# Altium schematic sheet LF_SFF_AC_DC.SchDoc: LF SFF ADC/DC
size A3; Author: Dominic Schüchter; Revision: v1.0
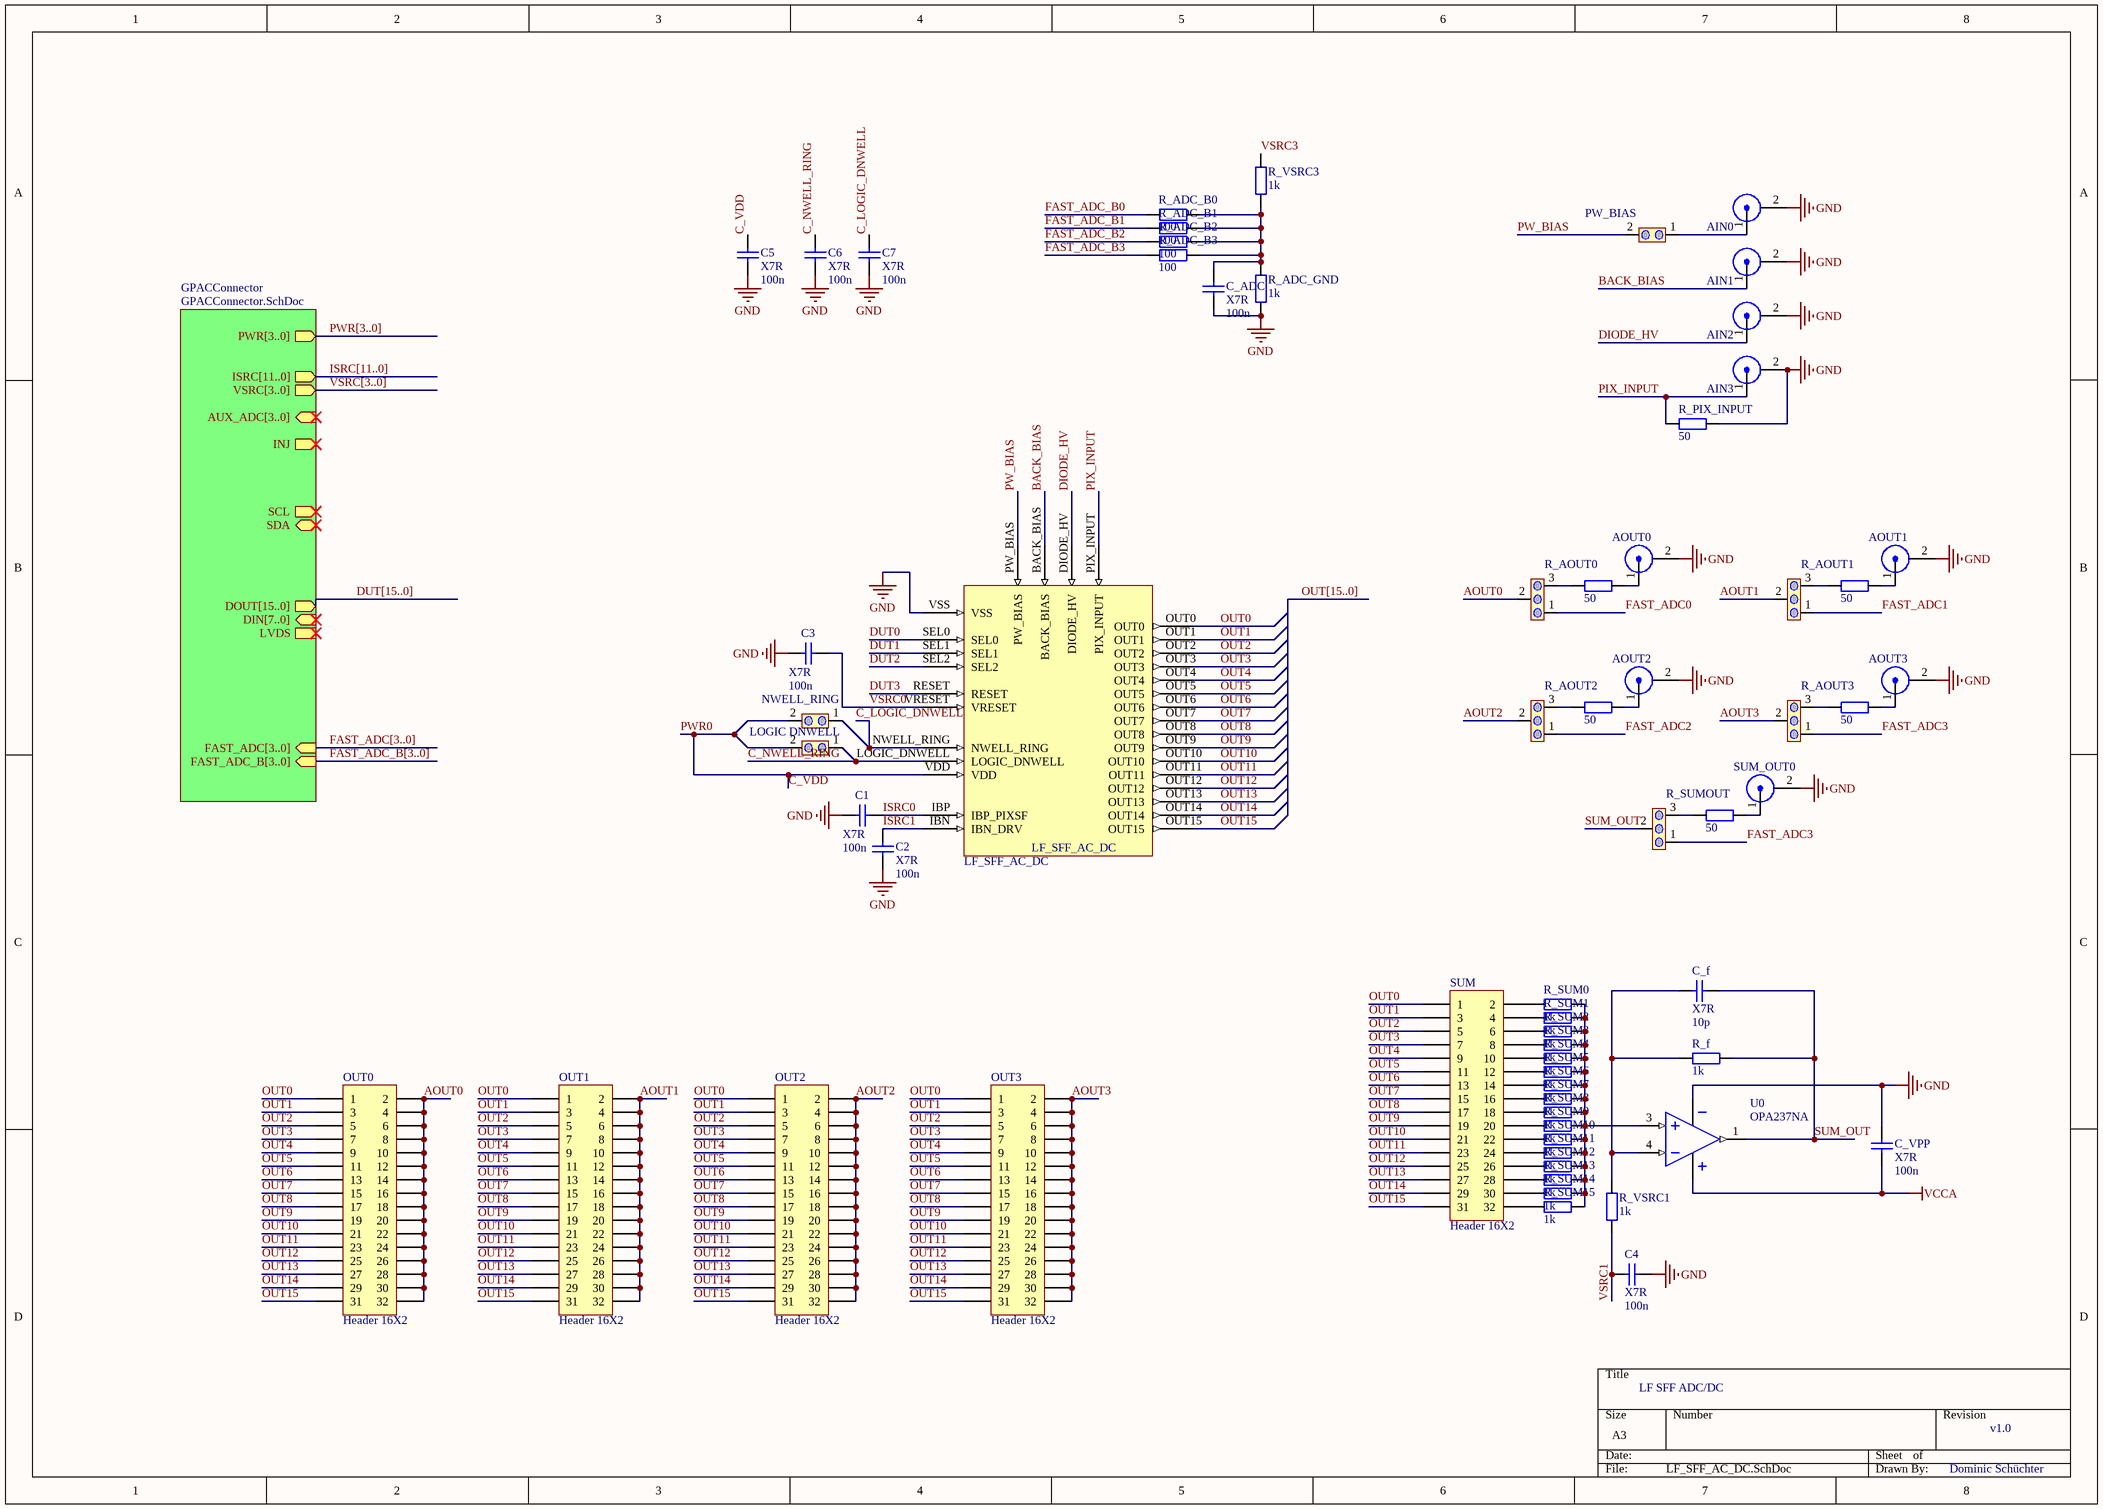
[diagram p0: LF_SFF_AC_DC.SchDoc]

## Parts
AIN0  -  [LEMO horiz.]  (value not drawn)
AIN1  -  [LEMO horiz.]  (value not drawn)
AIN2  -  [LEMO horiz.]  (value not drawn)
AIN3  -  [LEMO horiz.]  (value not drawn)
AOUT0  -  [LEMO horiz.]  (value not drawn)
AOUT1  -  [LEMO horiz.]  (value not drawn)
AOUT2  -  [LEMO horiz.]  (value not drawn)
AOUT3  -  [LEMO horiz.]  (value not drawn)
AOUT_SEL0  -  [HDR 1x3]  (value not drawn)
AOUT_SEL1  -  [HDR 1x3]  (value not drawn)
AOUT_SEL2  -  [HDR 1x3]  (value not drawn)
AOUT_SEL3  -  [HDR 1x3]  (value not drawn)
C1  X7R  value 100n  [C0603_imp_N]
C2  X7R  value 100n  [C0603_imp_N]
C3  X7R  value 100n  [C0603_imp_N]
C4  X7R  value 100n  [C0603_imp_N]
C5  X7R  value 100n  [C0603_imp_N]
C6  X7R  value 100n  [C0603_imp_N]
C7  X7R  value 100n  [C0603_imp_N]
C_ADC  X7R  value 100n  [C0603_imp_N]
C_f  X7R  value 10p  [C0603_imp_N]
C_VPP  X7R  value 100n  [C0603_imp_N]
LF_SFF_AC_DC  LF_SFF_AC_DC  [LF_SFF_COMBI]
LOGIC_DNWELL  -  [CON 1x2 std]  (value not drawn)
NWELL_RING  -  [CON 1x2 std]  (value not drawn)
OUT0  Header 16X2  [HDR2X16]
OUT1  Header 16X2  [HDR2X16]
OUT2  Header 16X2  [HDR2X16]
OUT3  Header 16X2  [HDR2X16]
PW_BIAS  -  [CON 1x2 std]  (value not drawn)
R_ADC_B0  value 100  [R0603_imp_N]  (hidden comment: R)
R_ADC_B1  value 100  [R0603_imp_N]  (hidden comment: R)
R_ADC_B2  value 100  [R0603_imp_N]  (hidden comment: R)
R_ADC_B3  value 100  [R0603_imp_N]  (hidden comment: R)
R_ADC_GND  value 1k  [R0603_imp_N]  (hidden comment: R)
R_AOUT0  value 50  [R0603_imp_N]  (hidden comment: R)
R_AOUT1  value 50  [R0603_imp_N]  (hidden comment: R)
R_AOUT2  value 50  [R0603_imp_N]  (hidden comment: R)
R_AOUT3  value 50  [R0603_imp_N]  (hidden comment: R)
R_f  value 1k  [R0805_imp_M]  (hidden comment: R)
R_PIX_INPUT  value 50  [R0603_imp_N]  (hidden comment: R)
R_SUM0  value 1k  [R0805_imp_M]  (hidden comment: R)
R_SUM1  value 1k  [R0805_imp_M]  (hidden comment: R)
R_SUM2  value 1k  [R0805_imp_M]  (hidden comment: R)
R_SUM3  value 1k  [R0805_imp_M]  (hidden comment: R)
R_SUM4  value 1k  [R0805_imp_M]  (hidden comment: R)
R_SUM5  value 1k  [R0805_imp_M]  (hidden comment: R)
R_SUM6  value 1k  [R0805_imp_M]  (hidden comment: R)
R_SUM7  value 1k  [R0805_imp_M]  (hidden comment: R)
R_SUM8  value 1k  [R0805_imp_M]  (hidden comment: R)
R_SUM9  value 1k  [R0805_imp_M]  (hidden comment: R)
R_SUM10  value 1k  [R0805_imp_M]  (hidden comment: R)
R_SUM11  value 1k  [R0805_imp_M]  (hidden comment: R)
R_SUM12  value 1k  [R0805_imp_M]  (hidden comment: R)
R_SUM13  value 1k  [R0805_imp_M]  (hidden comment: R)
R_SUM14  value 1k  [R0805_imp_M]  (hidden comment: R)
R_SUM15  value 1k  [R0805_imp_M]  (hidden comment: R)
R_SUMOUT  value 50  [R0603_imp_N]  (hidden comment: R)
R_VSRC1  value 1k  [R0805_imp_M]  (hidden comment: R)
R_VSRC3  value 1k  [R0603_imp_N]  (hidden comment: R)
SUM  Header 16X2  [HDR2X16]
SUM_OUT0  -  [LEMO horiz.]  (value not drawn)
SUM_SELECT  -  [HDR 1x3]  (value not drawn)
U0  Type_1: OPA237NA  [SOT23-5]  (hidden comment: OPA237)

## Sub-sheets
GPACConnector = GPACConnector.SchDoc: PWR[3..0] (out), ISRC[11..0] (out), VSRC[3..0] (out), AUX_ADC[3..0] (in), DOUT[15..0] (out), DIN[7..0] (in), FAST_ADC[3..0] (in), FAST_ADC_B[3..0] (in), LVDS (harness LVDS), INJ (out), SDA (bidir), SCL (out)

## Nets
GND: AIN0.2 AIN1.2 AIN2.2 AIN3.2 AOUT0.2 AOUT1.2 AOUT2.2 AOUT3.2 C1.2 C2.2 C3.2 C4.2 C5.2 C6.2 C7.2 C_ADC.1 C_VPP.1 LF_SFF_AC_DC.VSS R_ADC_GND.1 R_PIX_INPUT.2 SUM_OUT0.2 U0.2(V-)
VCCA: C_VPP.2 U0.5(V+)
AOUT0: AOUT_SEL0.2 OUT0.2 OUT0.4 OUT0.6 OUT0.8 OUT0.10 OUT0.12 OUT0.14 OUT0.16 OUT0.18 OUT0.20 OUT0.22 OUT0.24 OUT0.26 OUT0.28 OUT0.30 OUT0.32
AOUT1: AOUT_SEL1.2 OUT1.2 OUT1.4 OUT1.6 OUT1.8 OUT1.10 OUT1.12 OUT1.14 OUT1.16 OUT1.18 OUT1.20 OUT1.22 OUT1.24 OUT1.26 OUT1.28 OUT1.30 OUT1.32
AOUT2: AOUT_SEL2.2 OUT2.2 OUT2.4 OUT2.6 OUT2.8 OUT2.10 OUT2.12 OUT2.14 OUT2.16 OUT2.18 OUT2.20 OUT2.22 OUT2.24 OUT2.26 OUT2.28 OUT2.30 OUT2.32
AOUT3: AOUT_SEL3.2 OUT3.2 OUT3.4 OUT3.6 OUT3.8 OUT3.10 OUT3.12 OUT3.14 OUT3.16 OUT3.18 OUT3.20 OUT3.22 OUT3.24 OUT3.26 OUT3.28 OUT3.30 OUT3.32
BACK_BIAS: AIN1.1 LF_SFF_AC_DC.BACK_BIAS
C_LOGIC_DNWELL: C7.1 LF_SFF_AC_DC.NWELL_RING NWELL_RING.1
C_NWELL_RING: C6.1 LF_SFF_AC_DC.LOGIC_DNWELL LOGIC_DNWELL.1
C_VDD: C5.1 LF_SFF_AC_DC.VDD LOGIC_DNWELL.2 NWELL_RING.2  [also labelled PWR0]
DIODE_HV: AIN2.1 LF_SFF_AC_DC.DIODE_HV
DUT0: LF_SFF_AC_DC.SEL0
DUT1: LF_SFF_AC_DC.SEL1
DUT2: LF_SFF_AC_DC.SEL2
DUT3: LF_SFF_AC_DC.RESET
FAST_ADC0: AOUT_SEL0.1
FAST_ADC1: AOUT_SEL1.1
FAST_ADC2: AOUT_SEL2.1
FAST_ADC3: AOUT_SEL3.1 SUM_SELECT.1
FAST_ADC_B0: R_ADC_B0.1
FAST_ADC_B1: R_ADC_B1.1
FAST_ADC_B2: R_ADC_B2.1
FAST_ADC_B3: R_ADC_B3.1
ISRC0: C1.1 LF_SFF_AC_DC.IBP(IBP_PIXSF)
ISRC1: C2.1 LF_SFF_AC_DC.IBN(IBN_DRV)
OUT0: LF_SFF_AC_DC.OUT0 OUT0.1 OUT1.1 OUT2.1 OUT3.1 SUM.1
OUT1: LF_SFF_AC_DC.OUT1 OUT0.3 OUT1.3 OUT2.3 OUT3.3 SUM.3
OUT2: LF_SFF_AC_DC.OUT2 OUT0.5 OUT1.5 OUT2.5 OUT3.5 SUM.5
OUT3: LF_SFF_AC_DC.OUT3 OUT0.7 OUT1.7 OUT2.7 OUT3.7 SUM.7
OUT4: LF_SFF_AC_DC.OUT4 OUT0.9 OUT1.9 OUT2.9 OUT3.9 SUM.9
OUT5: LF_SFF_AC_DC.OUT5 OUT0.11 OUT1.11 OUT2.11 OUT3.11 SUM.11
OUT6: LF_SFF_AC_DC.OUT6 OUT0.13 OUT1.13 OUT2.13 OUT3.13 SUM.13
OUT7: LF_SFF_AC_DC.OUT7 OUT0.15 OUT1.15 OUT2.15 OUT3.15 SUM.15
OUT8: LF_SFF_AC_DC.OUT8 OUT0.17 OUT1.17 OUT2.17 OUT3.17 SUM.17
OUT9: LF_SFF_AC_DC.OUT9 OUT0.19 OUT1.19 OUT2.19 OUT3.19 SUM.19
OUT10: LF_SFF_AC_DC.OUT10 OUT0.21 OUT1.21 OUT2.21 OUT3.21 SUM.21
OUT11: LF_SFF_AC_DC.OUT11 OUT0.23 OUT1.23 OUT2.23 OUT3.23 SUM.23
OUT12: LF_SFF_AC_DC.OUT12 OUT0.25 OUT1.25 OUT2.25 OUT3.25 SUM.25
OUT13: LF_SFF_AC_DC.OUT13 OUT0.27 OUT1.27 OUT2.27 OUT3.27 SUM.27
OUT14: LF_SFF_AC_DC.OUT14 OUT0.29 OUT1.29 OUT2.29 OUT3.29 SUM.29
OUT15: LF_SFF_AC_DC.OUT15 OUT0.31 OUT1.31 OUT2.31 OUT3.31 SUM.31
PIX_INPUT: AIN3.1 LF_SFF_AC_DC.PIX_INPUT R_PIX_INPUT.1
PW_BIAS: LF_SFF_AC_DC.PW_BIAS PW_BIAS.2
SUM_OUT: C_f.2 R_f.2 SUM_SELECT.2 U0.1(OUT)
VSRC0: C3.1 LF_SFF_AC_DC.VRESET
VSRC1: C4.1 R_VSRC1.2
VSRC3: R_VSRC3.2
NetAIN0_1: AIN0.1 PW_BIAS.1
NetAOUT0_1: AOUT0.1 R_AOUT0.1
NetAOUT1_1: AOUT1.1 R_AOUT1.1
NetAOUT2_1: AOUT2.1 R_AOUT2.1
NetAOUT3_1: AOUT3.1 R_AOUT3.1
NetAOUT_SEL0_3: AOUT_SEL0.3 R_AOUT0.2
NetAOUT_SEL1_3: AOUT_SEL1.3 R_AOUT1.2
NetAOUT_SEL2_3: AOUT_SEL2.3 R_AOUT2.2
NetAOUT_SEL3_3: AOUT_SEL3.3 R_AOUT3.2
NetC_ADC_2: C_ADC.2 R_ADC_B0.2 R_ADC_B1.2 R_ADC_B2.2 R_ADC_B3.2 R_ADC_GND.2 R_VSRC3.1
NetC_f_1: C_f.1 R_f.1 R_VSRC1.1 U0.4(IN-)
NetR_SUM0_1: R_SUM0.1 SUM.2
NetR_SUM0_2: R_SUM0.2 R_SUM1.2 R_SUM2.2 R_SUM3.2 R_SUM4.2 R_SUM5.2 R_SUM6.2 R_SUM7.2 R_SUM8.2 R_SUM9.2 R_SUM10.2 R_SUM11.2 R_SUM12.2 R_SUM13.2 R_SUM14.2 R_SUM15.2 U0.3(IN+)
NetR_SUM1_1: R_SUM1.1 SUM.4
NetR_SUM2_1: R_SUM2.1 SUM.6
NetR_SUM3_1: R_SUM3.1 SUM.8
NetR_SUM4_1: R_SUM4.1 SUM.10
NetR_SUM5_1: R_SUM5.1 SUM.12
NetR_SUM6_1: R_SUM6.1 SUM.14
NetR_SUM7_1: R_SUM7.1 SUM.16
NetR_SUM8_1: R_SUM8.1 SUM.18
NetR_SUM9_1: R_SUM9.1 SUM.20
NetR_SUM10_1: R_SUM10.1 SUM.22
NetR_SUM11_1: R_SUM11.1 SUM.24
NetR_SUM12_1: R_SUM12.1 SUM.26
NetR_SUM13_1: R_SUM13.1 SUM.28
NetR_SUM14_1: R_SUM14.1 SUM.30
NetR_SUM15_1: R_SUM15.1 SUM.32
NetR_SUMOUT_1: R_SUMOUT.1 SUM_OUT0.1
NetR_SUMOUT_2: R_SUMOUT.2 SUM_SELECT.3

## Buses and harness runs
bus DUT[15..0] = sheet GPACConnector/DOUT[15..0]
bus FAST_ADC[3..0] = sheet GPACConnector/FAST_ADC[3..0]
bus FAST_ADC_B[3..0] = sheet GPACConnector/FAST_ADC_B[3..0]
bus ISRC[11..0] = sheet GPACConnector/ISRC[11..0]
bus OUT[15..0]
bus PWR[3..0] = sheet GPACConnector/PWR[3..0]
bus VSRC[3..0] = sheet GPACConnector/VSRC[3..0]

## Library data of the parts
AIN0-AIN3 AOUT0-AOUT3 SUM_OUT0 = LEMO coax: LEMO/BNC Buchse, aufrecht od. gewinkelt; Class: Connector; Comment_1: LEMO; Type_1: EPL.00.250.NTN; Constraints: -; HelpURL: -; LatestRevisionDate: 24-Sep-2008; Publisher: Silab C.H.; Value: -; PackageDescription: -
AOUT_SEL0-AOUT_SEL3 SUM_SELECT = JUMPER 1X3S: Jumper, Solderbridge 1x3; Class: Connector; Comment_1: -; Constraints: -; HelpURL: -; LatestRevisionDate: 24-Sep-2008; Publisher: Silab C.H.; Type_1: -; Value: -; PackageDescription: -
C1-C7 C_ADC C_f C_VPP = C: Capacitor; Constraints: 6.3V; Class: Passive; Type_1: SMD Chip Capacitor; Comment_1: -; LatestRevisionDate: 27-Nov-2007; Publisher: Silab J.S.; HelpURL: -; PackageDescription: -
LF_SFF_AC_DC = LF_SFF_AC
LOGIC_DNWELL NWELL_RING PW_BIAS = JUMPER 1X2S: Jumper, Solderbridge 1x2; Class: Connector; Comment_1: -; Constraints: -; HelpURL: -; LatestRevisionDate: 24-Sep-2008; Publisher: Silab C.H.; Type_1: -; Value: -; PackageDescription: -
OUT0-OUT3 SUM = Header 16X2: Header, 16-Pin, Dual row; LatestRevisionDate: 17-Jul-2002; LatestRevisionNote: Re-released for DXP Platform.; Publisher: Altium Limited
R_ADC_B0-R_ADC_B3 R_ADC_GND R_AOUT0-R_AOUT3 R_f R_PIX_INPUT R_SUM0-R_SUM15 R_SUMOUT R_VSRC1 R_VSRC3 = R: SMD Chip Resistor; Constraints: 1%; Class: Passive; Comment_1: -; Publisher: Silab J.S.; LatestRevisionDate: 27-Nov-2007; HelpURL: -; Type_1: SMD Chip Resistor; PackageDescription: -
U0 = OPA237: OpAmp (TI), single supply up to +36V;; Class: Active; Comment_1: Texas Instruments; Netto_price: 1,58; Order_number: 1207102; Constraints: -; HelpURL: http://focus.ti.com/lit/ds/symlink/opa237.pdf; LatestRevisionDate: 26-Aug-2009; Publisher: Silab J.S.; Value: -; PackageDescription: -; Distributor: Farnell